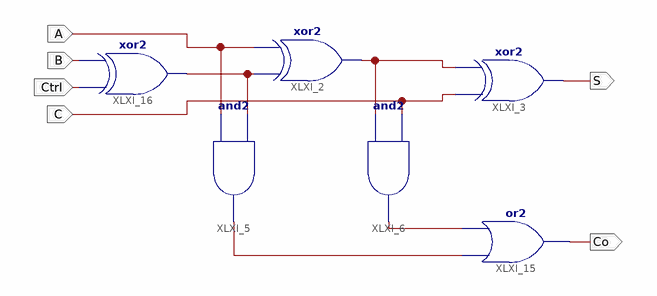
[diagram p0: schematic sheet 1]
// Xilinx ISE schematic AddSub1b.sch (kintex7) as structural Verilog: 6 symbols, 6 ports
module AddSub1b (
  input  A,
  input  C,
  input  Ctrl,
  input  B,
  output S,
  output Co
);

  wire XLXN_4, XLXN_11, XLXN_20, XLXN_21;

  xor XLXI_3 (S, C, XLXN_11);
  xor XLXI_2 (XLXN_11, XLXN_4, A);
  and XLXI_5 (XLXN_21, A, XLXN_4);
  and XLXI_6 (XLXN_20, XLXN_11, C);
  or XLXI_15 (Co, XLXN_21, XLXN_20);
  xor XLXI_16 (XLXN_4, Ctrl, B);
endmodule
